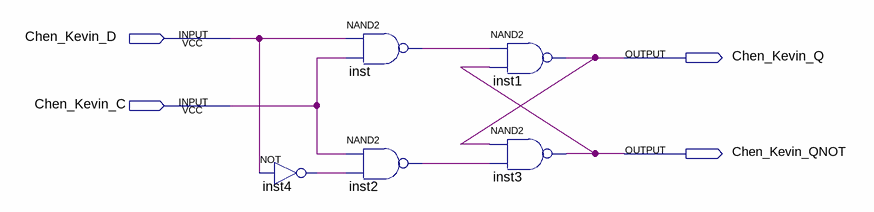
[diagram p0: schematic sheet]
// Quartus schematic Chen_Kevin_D-Latch.bdf as structural Verilog: 5 symbols, 4 pins
module \Chen_Kevin_D-Latch  (
  input  Chen_Kevin_D,
  input  Chen_Kevin_C,
  output Chen_Kevin_Q,
  output Chen_Kevin_QNOT
);

  wire inst2_out, inst4_out, inst_out;

  not inst4 (inst4_out, Chen_Kevin_D);
  nand inst (inst_out, Chen_Kevin_D, Chen_Kevin_C);
  nand inst2 (inst2_out, Chen_Kevin_C, inst4_out);
  nand inst1 (Chen_Kevin_Q, inst_out, Chen_Kevin_QNOT);
  nand inst3 (Chen_Kevin_QNOT, Chen_Kevin_Q, inst2_out);
endmodule
